# Altium schematic sheet sch.SchDoc
size A3
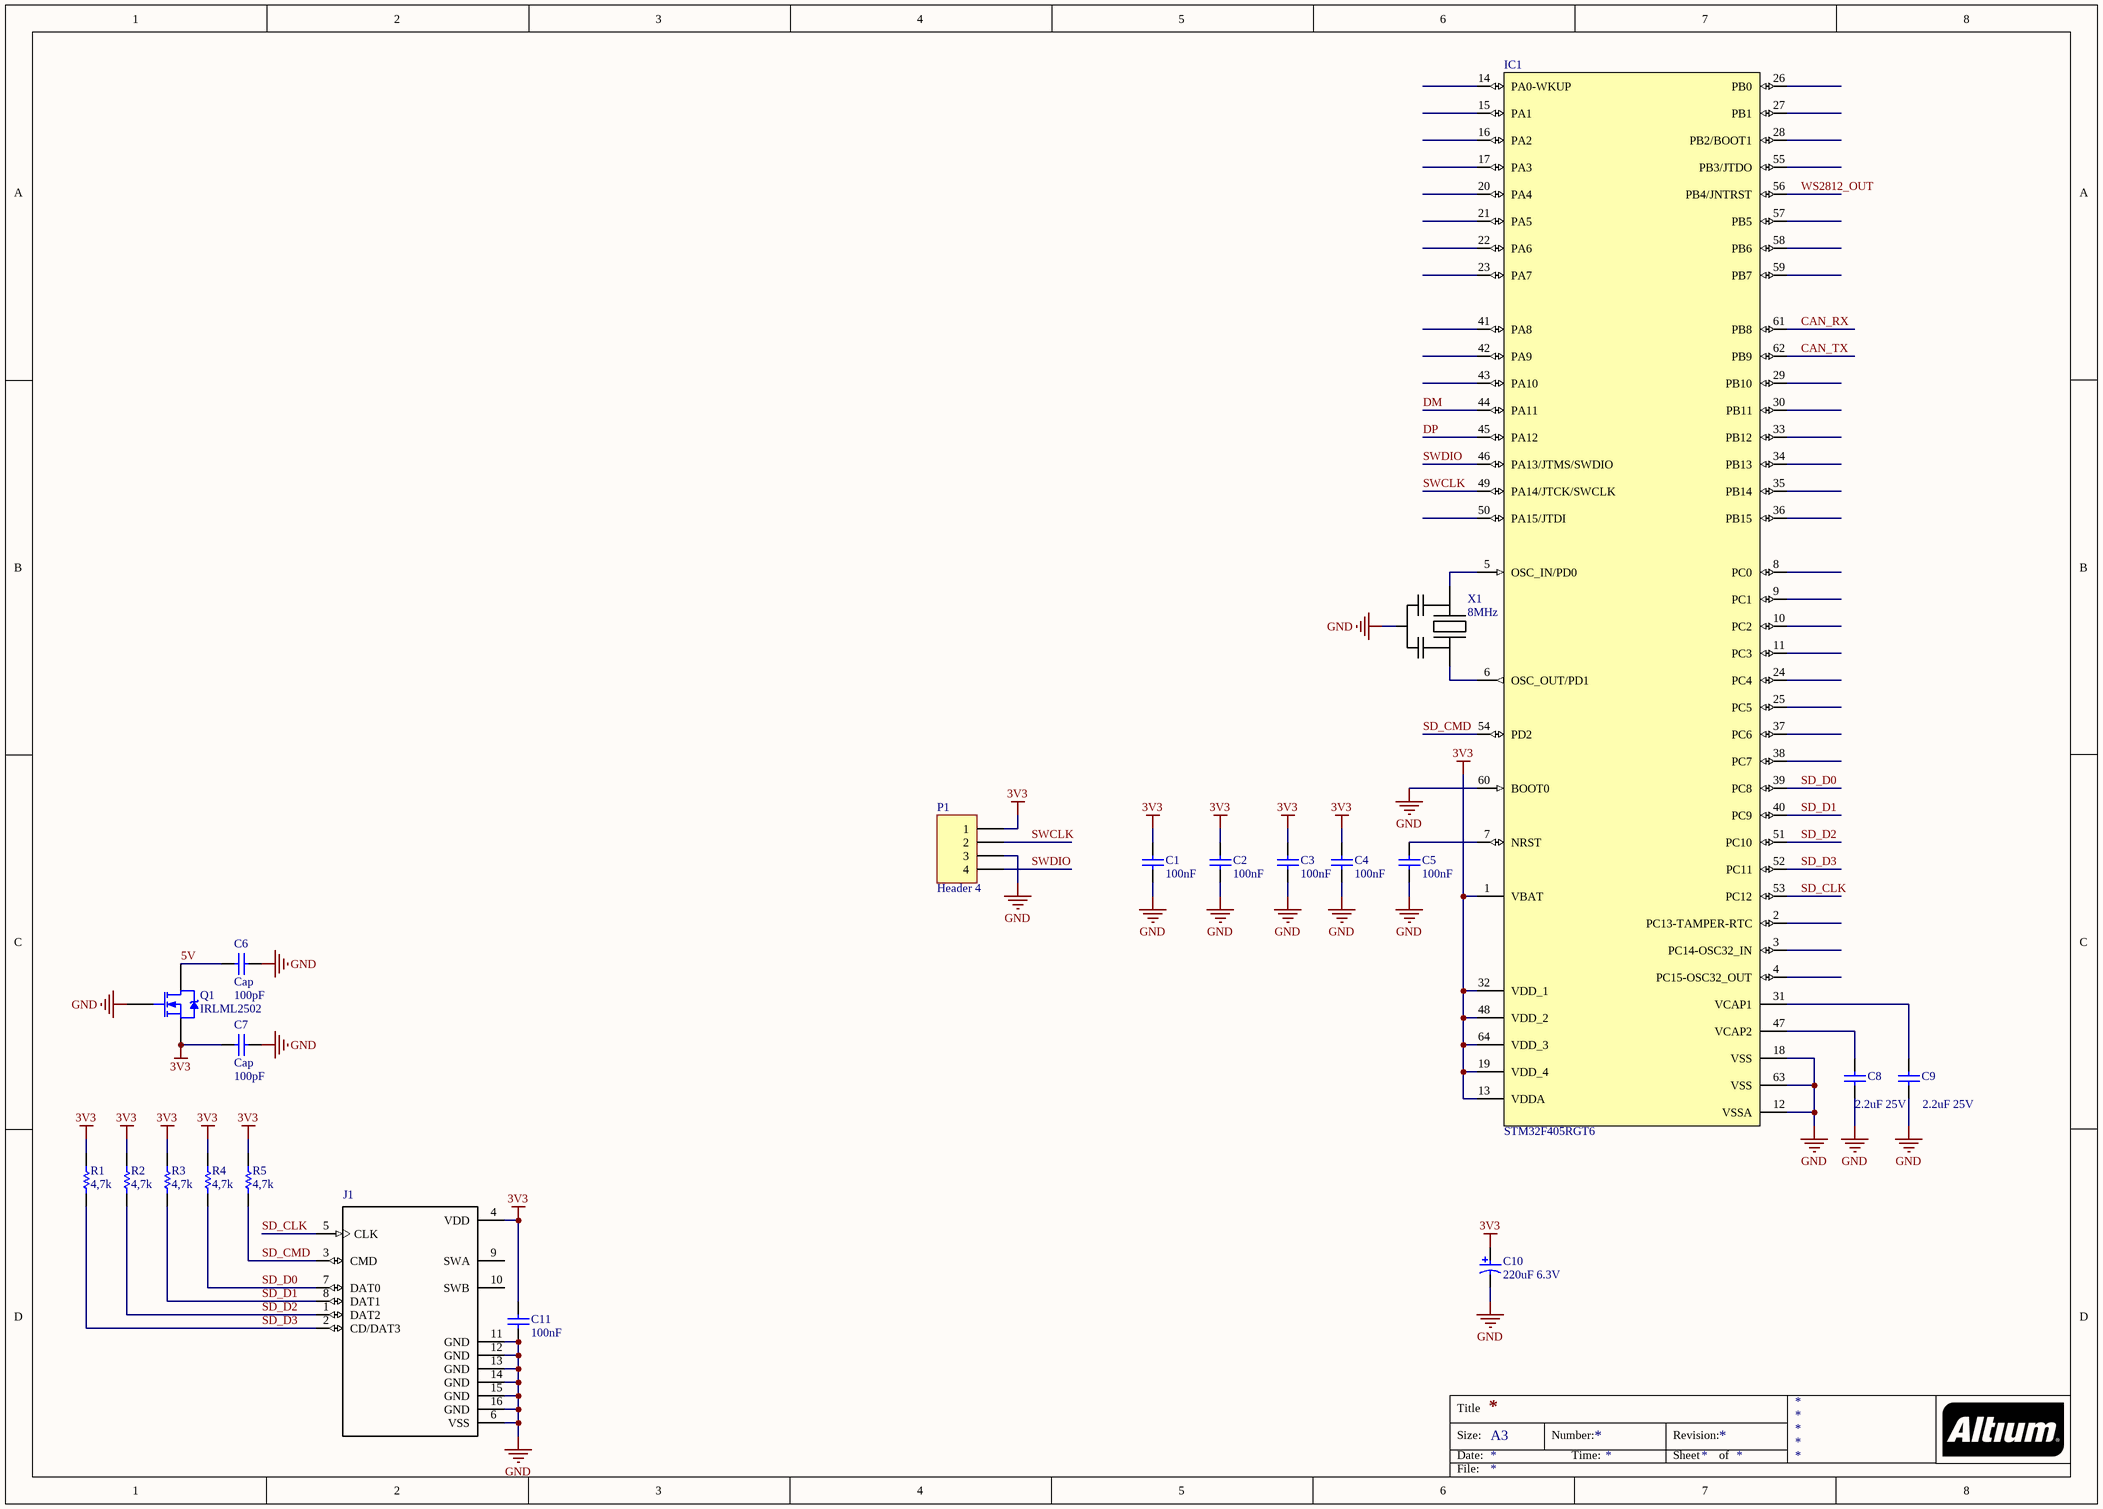
[diagram p0: sch.SchDoc]

## Parts
C1  100nF  [RR_0603]
C2  100nF  [RR_0603]
C3  100nF  [RR_0603]
C4  100nF  [RR_0603]
C5  100nF  [RR_0603]
C6  Cap  value 100pF  [RC_1210_T1.8]
C7  Cap  value 100pF  [RC_1210_T1.8]
C8  2.2uF 25V  [RC_0603]
C9  2.2uF 25V  [RC_0603]
C10  220uF 6.3V  [RR_CAP-C]
C11  100nF  [RR_0603]
IC1  STM32F405RGT6  [RR_LQFP-64_L_ROUND]
J1  MICROSD_2201778-1  [RR_CONN_MICROSD_TE_2201778-1]  (value not drawn)
P1  Header 4  [MHDR1X4]
Q1  IRLML2502  [RR_SOT-23]
R1  4,7k  [RR_0603]
R2  4,7k  [RR_0603]
R3  4,7k  [RR_0603]
R4  4,7k  [RR_0603]
R5  4,7k  [RR_0603]
X1  8MHz  [RR_CRYSTAL_3.2X1.3]

## Nets
3V3: C1.2 C2.2 C3.2 C4.2 C7.2 C10.1 C11.1 IC1.1(VBAT) IC1.13(VDDA) IC1.19(VDD_4) IC1.32(VDD_1) IC1.48(VDD_2) IC1.64(VDD_3) J1.4(VDD) P1.1 Q1.2(S) R1.2 R2.2 R3.2 R4.2 R5.2
GND: C1.1 C2.1 C3.1 C4.1 C5.1 C6.1 C7.1 C8.2 C9.2 C10.2 C11.2 IC1.12(VSSA) IC1.18(VSS) IC1.60(BOOT0) IC1.63(VSS) J1.6(VSS) J1.11(GND) J1.12(GND) J1.13(GND) J1.14(GND) J1.15(GND) J1.16(GND) P1.3 Q1.1(G) X1.2(GND)
5V: C6.2 Q1.3(D)
CAN_RX: IC1.61(PB8)
CAN_TX: IC1.62(PB9)
DM: IC1.44(PA11)
DP: IC1.45(PA12)
SD_CLK: IC1.53(PC12) J1.5(CLK)
SD_CMD: IC1.54(PD2) J1.3(CMD) R5.1
SD_D0: IC1.39(PC8) J1.7(DAT0) R4.1
SD_D1: IC1.40(PC9) J1.8(DAT1) R3.1
SD_D2: IC1.51(PC10) J1.1(DAT2) R2.1
SD_D3: IC1.52(PC11) J1.2(CD/DAT3) R1.1
SWCLK: IC1.49(PA14/JTCK/SWCLK) P1.2
SWDIO: IC1.46(PA13/JTMS/SWDIO) P1.4
WS2812_OUT: IC1.56(PB4/JNTRST)
NetC5_2: C5.2 IC1.7(NRST)
NetC8_1: C8.1 IC1.47(VCAP2)
NetC9_1: C9.1 IC1.31(VCAP1)
NetIC1_5: IC1.5(OSC_IN/PD0) X1.1(X1)
NetIC1_6: IC1.6(OSC_OUT/PD1) X1.3(X2)

Not connected (* = marked no-connect by the designer): IC1 2(PC13-TAMPER-RTC) 3(PC14-OSC32_IN) 4(PC15-OSC32_OUT) 8(PC0) 9(PC1) 10(PC2) 11(PC3) 14(PA0-WKUP) 15(PA1) 16(PA2) 17(PA3) 20(PA4) 21(PA5) 22(PA6) 23(PA7) 24(PC4) 25(PC5) 26(PB0) 27(PB1) 28(PB2/BOOT1) 29(PB10) 30(PB11) 33(PB12) 34(PB13) 35(PB14) 36(PB15) 37(PC6) 38(PC7) 41(PA8) 42(PA9) 43(PA10) 50(PA15/JTDI) 55(PB3/JTDO) 57(PB5) 58(PB6) 59(PB7); J1 9(SWA) 10(SWB)

## Notes on the sheet
- Title
- Size:
- Date:
- A3
- Number:
- Time:
- Revision:
- Sheet
- of
- File:

## Library data of the parts
C1-C5 C11 = CAP-0603-104-25V: CAPACITOR CHIP; Manufacturer: Vishay Vitramon; Value: CAP CER 0.1UF 25V X7R 0603; Order Number: VJ0603Y104KXXAC; Cost: 0,07; Package: 0603
C6 C7 = Cap: Capacitor; Published: 8-Jun-2000; LatestRevisionDate: 17-Jul-2002; LatestRevisionNote: Re-released for DXP Platform.; PackageReference: RAD-0.3; Publisher: Altium Limited; PackageDescription: Radial Cap, Thru-Hole; 2 Leads; 0.3 in Pin Spacing
C8 C9 = CAP-0603-225-25V: CAPACITOR CHIP; Manufacturer: Murata; Value: CAP CER 2.2UF 25V X5R 0603; Order Number: GRM188R61E225KA12D; Cost: 0,15; Package: 0603
C10 = CAP-TANT-C-227-6.3V: CAPACITOR TANTAL CASE C; Manufacturer: KEMET; Value: CAP TANT POLY 220UF 6.3V 2312 15mOhm; Order Number: T520C227M006ATE015; Cost: 1,93; Package: Case C
IC1 = STM32F405RGT6_RR: STM32 ARM-based 32-bit MCU; Manufacturer: STMicroelectronics; Order Number: STM32F405RGT6; Package: LQFP-64; Value: STM32F405RGT6; Cost: 10,58
J1 = MICROSD_2201778-1: MICRO SD PUSH PUSH LOW PROFILE TYPE; Manufacturer: TE Connectivity AMP Connectors; Value: MICRO SD PUSH PUSH LOW PROFILE T; Cost: 2,57; Order number: 2201778-1
P1 = Header 4: Header, 4-Pin; Value: 1x4 100mil pitch header
Q1 = IRLML2502: MOSFET N-CH 20V 4.2A SOT-23-3; Manufacturer: Infineon Technologies; Order Number: IRLML2502GTRPBF ( IRLML6246TRPBF (INFIN)); Cost: 0,52; Package: SOT-23; Value: MOSFET N-CH 20V 4.2A SOT-23-3
R1-R5 = RES-0603-4K7-5%: RESISTOR; Manufacturer: Panasonic Electronic Components; Value: RES SMD 4K7 OHM 5% 1/10W 0603; Order Number: ERJ-PA3J472V; Cost: 0.1; Package: 0603
X1 = CSTCE8M00G55-R0: XTAL 8.0000MHZ 33PF SMD; Manufacturer: Murata Electronics; Value: CER RES 8.0000MHZ 33PF SMD; Order Number: CSTCE8M00G55-R0; Package: 3-SMD 3,2mm x 1,3mm; Cost: 0,48